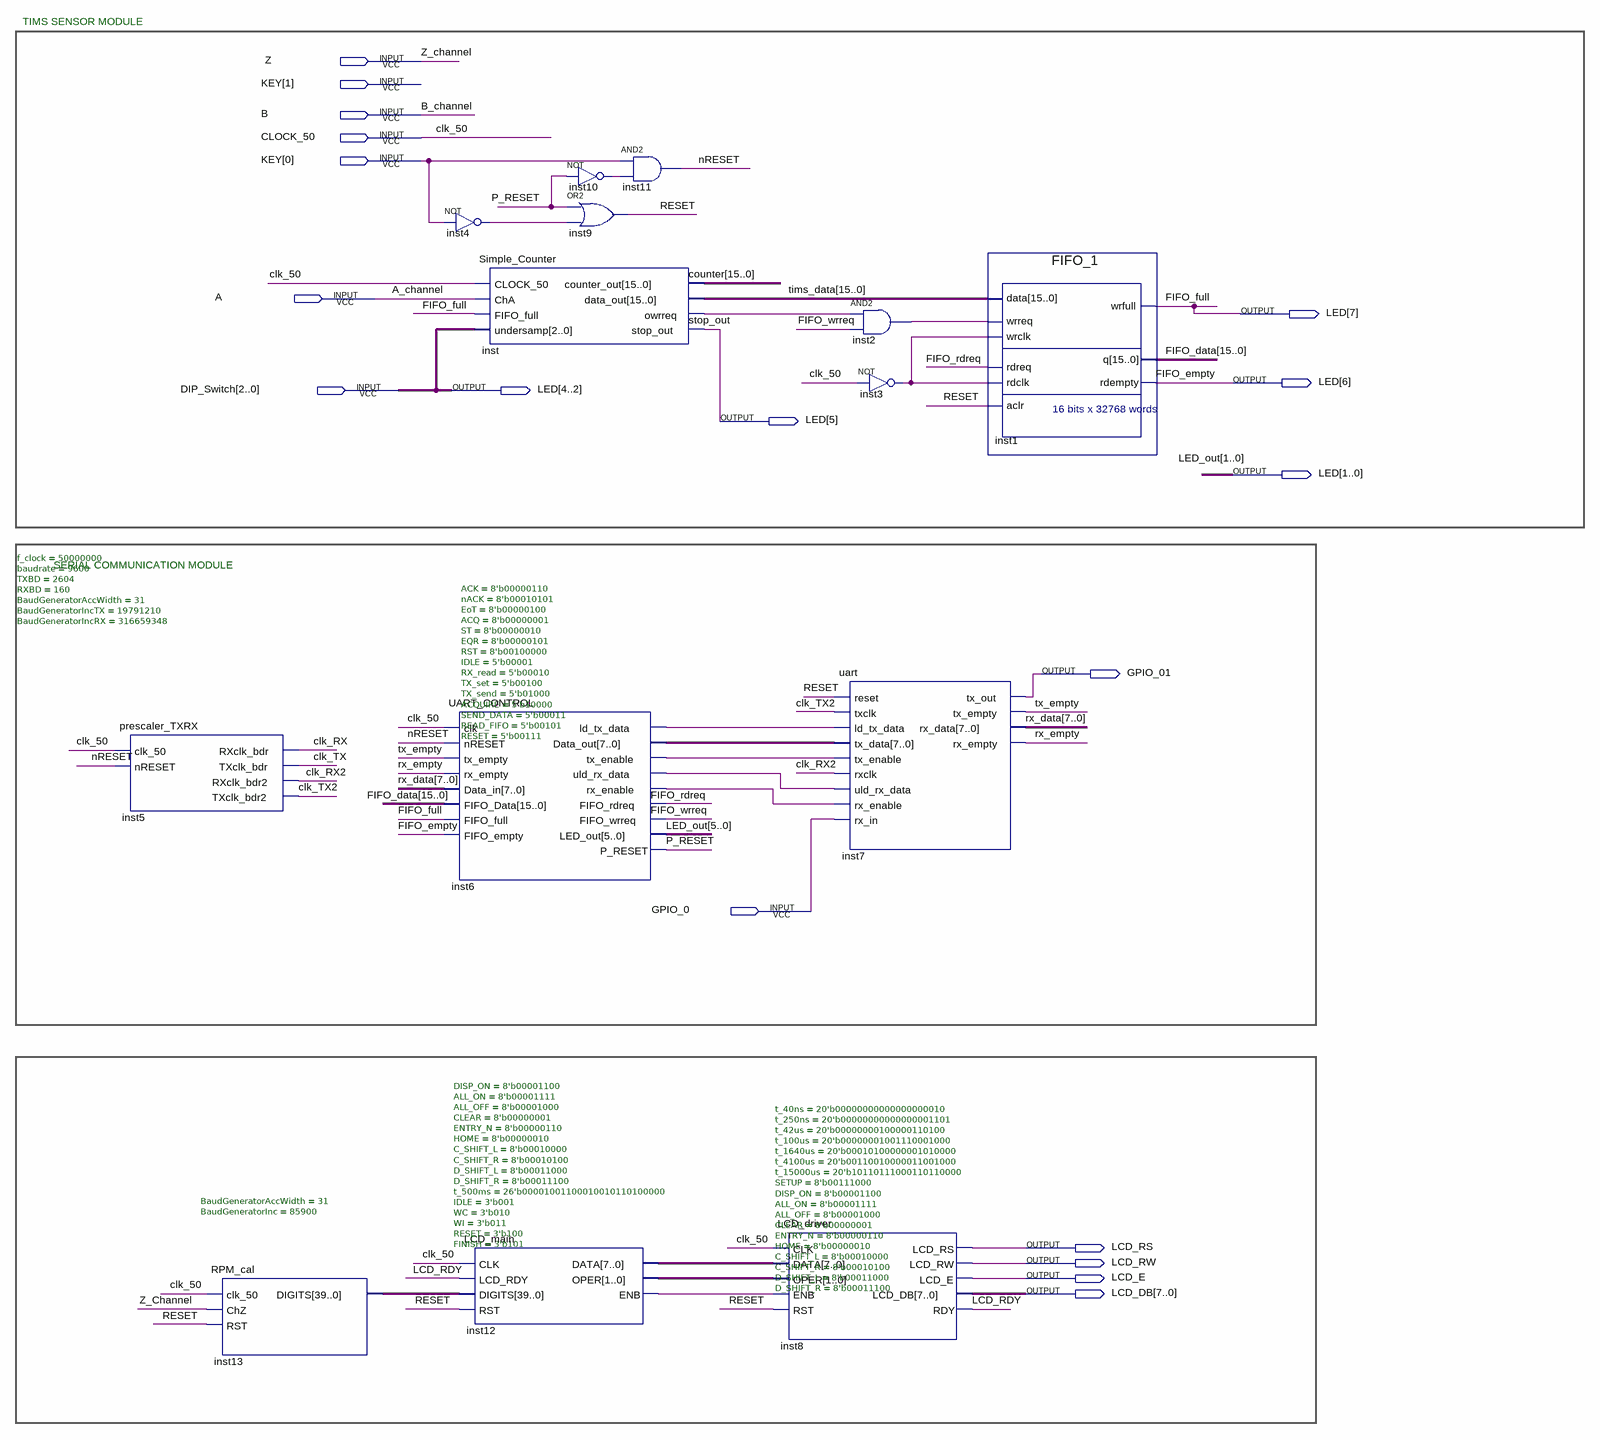
[diagram p0: schematic sheet]
// Quartus schematic TIMS_sensor_main.bdf as structural Verilog: 14 symbols, 18 pins
module TIMS_sensor_main (
  input  Z,
  input  [1:0] KEY,
  input  B,
  input  CLOCK_50,
  input  A,
  input  [2:0] DIP_Switch,
  input  GPIO_0,
  output [7:0] LED,
  output GPIO_01,
  output LCD_RS,
  output LCD_RW,
  output LCD_E,
  output [7:0] LCD_DB
);

  wire clk_RX, clk_RX2, clk_TX, clk_TX2, FIFO_rdreq, FIFO_wrreq, inst2_out, inst3_out, inst4_out,
       inst6_ld_tx_data, inst6_rx_enable, inst6_tx_enable, inst6_uld_rx_data, inst10_out, inst12_enb,
       inst_owrreq, LCD_RDY, nRESET, P_RESET, RESET, rx_empty, tx_empty;
  wire [1:0] inst12_oper;
  wire [5:2] LED_out;
  wire [7:0] inst6_data_out, inst12_data, rx_data;
  wire [15:0] counter, FIFO_data, tims_data;
  wire [39:0] inst13_digits;

  prescaler_TXRX #(.f_clock(50000000), .baudrate(9600), .TXBD(2604), .RXBD(160), .BaudGeneratorAccWidth(31), .BaudGeneratorIncTX(19791210), .BaudGeneratorIncRX(316659348)) inst5 (
    .clk_50(CLOCK_50), .nRESET(nRESET), .RXclk_bdr(clk_RX), .TXclk_bdr(clk_TX), .RXclk_bdr2(clk_RX2),
    .TXclk_bdr2(clk_TX2));
  RPM_cal #(.BaudGeneratorAccWidth(31), .BaudGeneratorInc(85900)) inst13 (
    .clk_50(CLOCK_50), .ChZ(Z), .RST(RESET), .DIGITS(inst13_digits));
  not inst4 (inst4_out, KEY[0]);
  Simple_Counter inst (
    .CLOCK_50(CLOCK_50), .ChA(A), .FIFO_full(LED[7]), .undersamp(DIP_Switch), .counter_out(counter),
    .data_out(tims_data), .owrreq(inst_owrreq), .stop_out(LED[5]));
  UART_CONTROL #(.ACK(8'b00000110), .nACK(8'b00010101), .EoT(8'b00000100), .ACQ(8'b00000001), .ST(8'b00000010), .EQR(8'b00000101), .RST(8'b00100000), .IDLE(5'b00001), .RX_read(5'b00010), .TX_set(5'b00100), .TX_send(5'b01000), .ACQUIRE(5'b10000), .SEND_DATA(5'b00011), .READ_FIFO(5'b00101), .RESET(5'b00111)) inst6 (
    .clk(CLOCK_50), .nRESET(nRESET), .tx_empty(tx_empty), .rx_empty(rx_empty), .Data_in(rx_data),
    .FIFO_Data(FIFO_data), .FIFO_full(LED[7]), .FIFO_empty(LED[6]), .ld_tx_data(inst6_ld_tx_data),
    .Data_out(inst6_data_out), .tx_enable(inst6_tx_enable), .uld_rx_data(inst6_uld_rx_data),
    .rx_enable(inst6_rx_enable), .FIFO_rdreq(FIFO_rdreq), .FIFO_wrreq(FIFO_wrreq),
    .LED_out({LED_out, LED[1:0]}), .P_RESET(P_RESET));
  LCD_main #(.DISP_ON(8'b00001100), .ALL_ON(8'b00001111), .ALL_OFF(8'b00001000), .CLEAR(8'b00000001), .ENTRY_N(8'b00000110), .HOME(8'b00000010), .C_SHIFT_L(8'b00010000), .C_SHIFT_R(8'b00010100), .D_SHIFT_L(8'b00011000), .D_SHIFT_R(8'b00011100), .t_500ms(26'b00001001100010010110100000), .IDLE(3'b001), .WC(3'b010), .WI(3'b011), .RESET(3'b100), .FINISH(3'b101)) inst12 (
    .CLK(CLOCK_50), .LCD_RDY(LCD_RDY), .DIGITS(inst13_digits), .RST(RESET), .DATA(inst12_data),
    .OPER(inst12_oper), .ENB(inst12_enb));
  not inst10 (inst10_out, P_RESET);
  or inst9 (RESET, P_RESET, inst4_out);
  and inst11 (nRESET, KEY[0], inst10_out);
  LCD_driver #(.t_40ns(20'b00000000000000000010), .t_250ns(20'b00000000000000001101), .t_42us(20'b00000000100000110100), .t_100us(20'b00000001001110001000), .t_1640us(20'b00010100000001010000), .t_4100us(20'b00110010000011001000), .t_15000us(20'b10110111000110110000), .SETUP(8'b00111000), .DISP_ON(8'b00001100), .ALL_ON(8'b00001111), .ALL_OFF(8'b00001000), .CLEAR(8'b00000001), .ENTRY_N(8'b00000110), .HOME(8'b00000010), .C_SHIFT_L(8'b00010000), .C_SHIFT_R(8'b00010100), .D_SHIFT_L(8'b00011000), .D_SHIFT_R(8'b00011100)) inst8 (
    .CLK(CLOCK_50), .DATA(inst12_data), .OPER(inst12_oper), .ENB(inst12_enb), .RST(RESET), .LCD_RS(LCD_RS),
    .LCD_RW(LCD_RW), .LCD_E(LCD_E), .LCD_DB(LCD_DB), .RDY(LCD_RDY));
  uart inst7 (
    .reset(RESET), .txclk(clk_TX2), .ld_tx_data(inst6_ld_tx_data), .tx_data(inst6_data_out),
    .tx_enable(inst6_tx_enable), .rxclk(clk_RX2), .uld_rx_data(inst6_uld_rx_data),
    .rx_enable(inst6_rx_enable), .rx_in(GPIO_0), .tx_out(GPIO_01), .tx_empty(tx_empty), .rx_data(rx_data),
    .rx_empty(rx_empty));
  and inst2 (inst2_out, inst_owrreq, FIFO_wrreq);
  not inst3 (inst3_out, CLOCK_50);
  FIFO_1 inst1 (
    .data(tims_data), .wrreq(inst2_out), .wrclk(inst3_out), .rdreq(FIFO_rdreq), .rdclk(inst3_out),
    .aclr(RESET), .wrfull(LED[7]), .q(FIFO_data), .rdempty(LED[6]));

  assign LED[4:2] = DIP_Switch;

  // Other names for the same wires on the sheet: A_channel = A; B_channel = B; clk_50 = CLOCK_50; FIFO_empty = LED[6];
  //   stop_out = LED[5]; FIFO_full = LED[7]; LED_out[1:0] = LED[1:0]; Z_channel = Z

  // Notes on the sheet:
  //   TIMS SENSOR MODULE
  //   SERIAL COMMUNICATION MODULE
endmodule
